# EAGLE schematic Sensor board v6 (EAGLE 9.7.0)
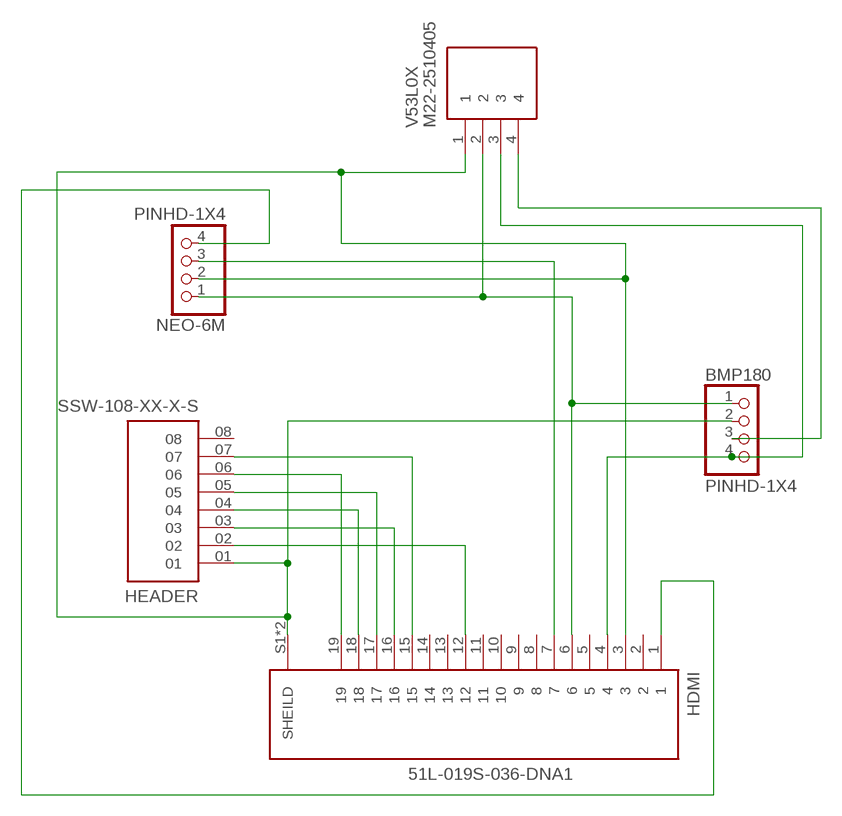
[diagram p0: schematic, sheet 1]

## Parts
BMP180  PINHD-1X4  [1X04]
HDMI  51L-019S-036-DNA1  [VALCON_51L-019S-036-DNA1]
HEADER  SSW-108-XX-X-S  [SAMTEC_SSW-108-XX-X-S]
NEO-6M  PINHD-1X4  [1X04]
V53L0X  M22-2510405  [HDRV4W50P0X200_1X4_800X200X525]

## Nets
3V3: HDMI.15 HEADER.07
5V: BMP180.1 HDMI.6 NEO-6M.1 V53L0X.2
CE0: HDMI.18 HEADER.04
CE1: HDMI.12 HEADER.02
GND: BMP180.2 HDMI.3 HDMI.S1(SHEILD) HDMI.S2(SHEILD) HEADER.01 NEO-6M.2 V53L0X.1
MISO: HDMI.17 HEADER.05
MOSI: HDMI.19 HEADER.06
RX: HDMI.7 NEO-6M.3
SCL: BMP180.3 V53L0X.4
SCLK: HDMI.16 HEADER.03
SDA: BMP180.4 HDMI.4 V53L0X.3
TX: HDMI.1 NEO-6M.4
Unconnected: HDMI.2 HDMI.5 HDMI.8 HDMI.9 HDMI.10 HDMI.11 HDMI.13 HDMI.14 HEADER.08

## Library data of the parts
BMP180 NEO-6M = Connector:PINHD-1X4: PIN HEADER; CATEGORY: CONNECTOR; SUB-CATEGORY: PIN-HEADER
HDMI = 51L-019S-036-DNA1:51L-019S-036-DNA1: 51L - Valcon Through Hole PCB Mount HDMI Type Sockets; MANUFACTURER: Valcon; MAXIMUM_PACKAGE_HEIGHT: 15.4mm; PARTREV: 27 Apr, 2021; STANDARD: Manufacturer recommendations
HEADER = SSW-108-XX-X-S:SSW-108-XX-X-S: Conn Socket Strip SKT 8 POS 2.54mm Solder ST Top Entry Thru-Hole Tube; MANUFACTURER: Samtec; PARTREV: A; STANDARD: Manufacturer Recommendations
V53L0X = M22-2510405:M22-2510405: 2.00mm (0.079") Pitch SIL Vertical 2.4mm Throughboard Pin Header, 3.5mm mating pin height, gold, 4 contacts Source: Datasheet <https://cdn.harwin.com/pdfs/M22-251.pdf>; DESCRIPTION: 2.00mm (0.079") Pitch SIL Vertical 2.4mm Throughboard Pin Header, 3.5mm mating pin height, gold, 4 contacts; HEIGHT: 5.25mm; MANUFACTURER_NAME: Harwin; MANUFACTURER_PART_NUMBER: M22-2510405; MOUSER_PART_NUMBER: 855-M22-2510405; MOUSER_PRICE-STOCK: https://www.mouser.co.uk/ProductDetail/Harwin/M22-2510405?qs=vF78I%252BjhbY9z7PsFZBZ5CA%3D%3D